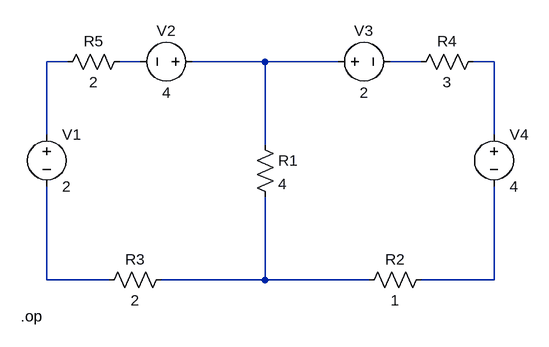
[diagram p0: schematic circuit.asc]
circuit.asc, the LTspice schematic file:
Version 4.1
SHEET 1 880 680
WIRE 112 16 80 16
WIRE 224 16 192 16
WIRE 416 16 304 16
WIRE 528 16 416 16
WIRE 656 16 608 16
WIRE 768 16 736 16
WIRE 80 128 80 16
WIRE 768 128 768 16
WIRE 416 144 416 16
WIRE 80 352 80 208
WIRE 176 352 80 352
WIRE 416 352 416 224
WIRE 416 352 256 352
WIRE 576 352 416 352
WIRE 768 352 768 208
WIRE 768 352 656 352
DATAFLAG 336 16 ""
DATAFLAG 336 16 ""
DATAFLAG 80 96 ""
DATAFLAG 480 16 ""
DATAFLAG 768 80 ""
DATAFLAG 736 352 ""
DATAFLAG 336 352 ""
DATAFLAG 416 96 ""
DATAFLAG 416 256 ""
DATAFLAG 528 352 ""
DATAFLAG 128 352 ""
SYMBOL voltage 80 112 R0
SYMATTR InstName V1
SYMATTR Value 2
SYMBOL voltage 320 16 R90
WINDOW 0 -32 56 VBottom 2
WINDOW 3 32 56 VTop 2
SYMATTR InstName V2
SYMATTR Value 4
SYMBOL voltage 512 16 R270
WINDOW 0 32 56 VTop 2
WINDOW 3 -32 56 VBottom 2
SYMATTR InstName V3
SYMATTR Value 2
SYMBOL voltage 768 112 R0
SYMATTR InstName V4
SYMATTR Value 4
SYMBOL res 400 128 R0
SYMATTR InstName R1
SYMATTR Value 4
SYMBOL res 672 336 R90
WINDOW 0 0 56 VBottom 2
WINDOW 3 32 56 VTop 2
SYMATTR InstName R2
SYMATTR Value 1
SYMBOL res 272 336 R90
WINDOW 0 0 56 VBottom 2
WINDOW 3 32 56 VTop 2
SYMATTR InstName R3
SYMATTR Value 2
SYMBOL res 752 0 R90
WINDOW 0 0 56 VBottom 2
WINDOW 3 32 56 VTop 2
SYMATTR InstName R4
SYMATTR Value 3
SYMBOL res 208 0 R90
WINDOW 0 0 56 VBottom 2
WINDOW 3 32 56 VTop 2
SYMATTR InstName R5
SYMATTR Value 2
TEXT 40 408 Left 2 !.op

The netlist it stands for:
* circuit.asc
V1 N001 N006 2
V2 N003 N002 4
V3 N003 N004 2
V4 N005 N008 4
R1 N003 N007 4
R2 N008 N007 1
R3 N007 N006 2
R4 N005 N004 3
R5 N002 N001 2
.op
.backanno
.end